# EAGLE design MOD-WiFi-ESP8266_Rev_B1 (EAGLE 4.16)
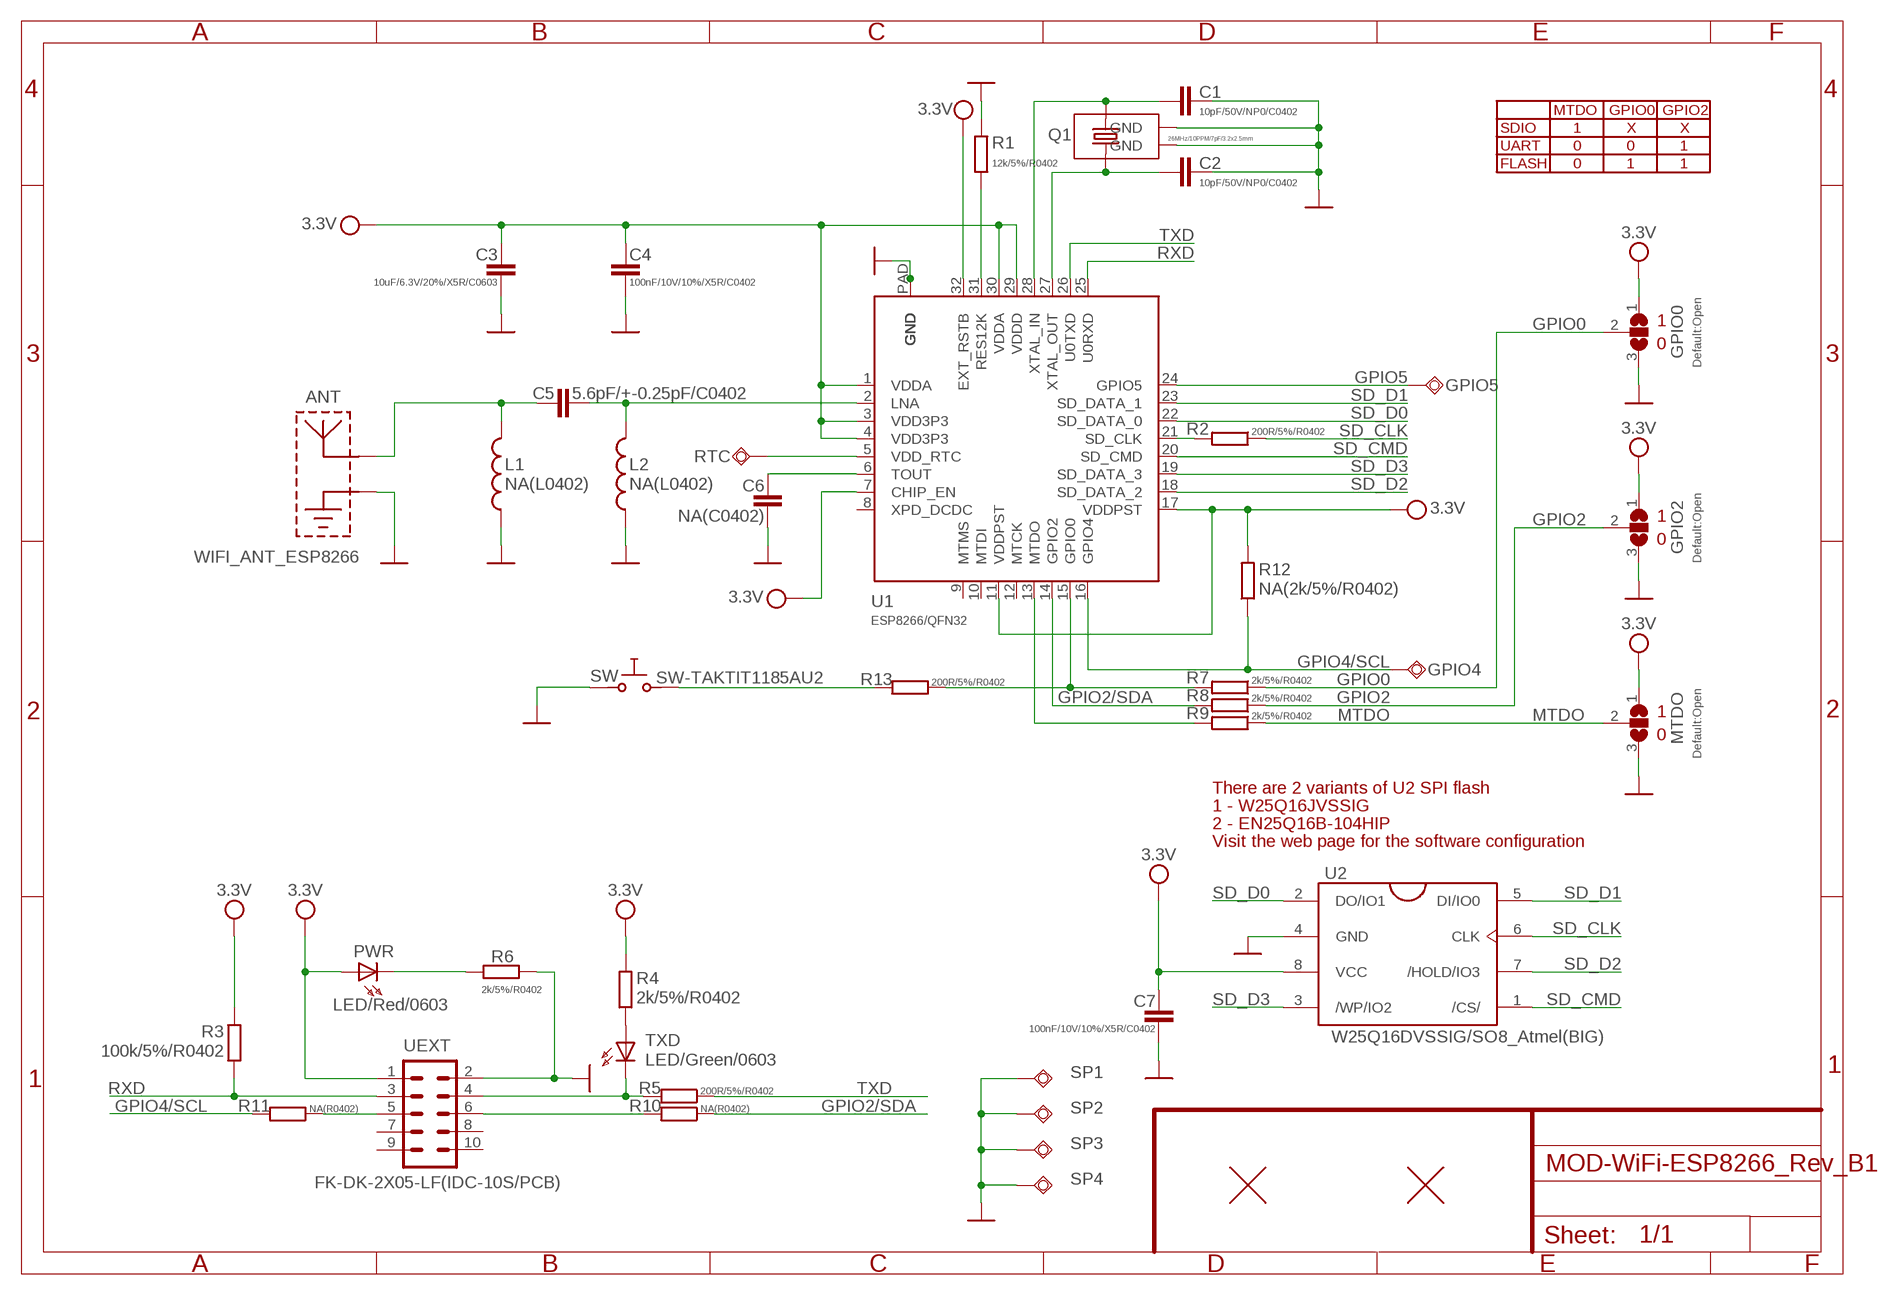
[diagram p0: schematic, sheet 1]

## Parts
ANT  WIFI_ANT_ESP8266  [ESP8266_ANT]
C1  10pF/50V/NP0/C0402  C-EUC0402_TI  [C0402_TI]
C2  10pF/50V/NP0/C0402  C-EUC0402_TI  [C0402_TI]
C3  10uF/6.3V/20%/X5R/C0603  C-EUC0603_DWS  [C0603_DWS]
C4  100nF/10V/10%/X5R/C0402  C-EUC0402_TI  [C0402_TI]
C5  5.6pF/+-0.25pF/C0402  C-EUC0402_TI  [C0402_TI]
C6  NA(C0402)  C-EUC0402_TI  [C0402_TI]
C7  100nF/10V/10%/X5R/C0402  C-EUC0402_TI  [C0402_TI]
GPIO0  Default:Open  SJ2W4  [SJ_2_SMALLER]
GPIO2  Default:Open  SJ2W4  [SJ_2_SMALLER]
GPIO4  TESTPAD32/56  [TESTPAD32/56]
GPIO5  TESTPAD32/56  [TESTPAD32/56]
L1  NA(L0402)  L-USL0402_TI  [L0402_TI]
L2  NA(L0402)  L-USL0402_TI  [L0402_TI]
MTDO  Default:Open  SJ2W4  [SJ_2_SMALLER]
PWR  LED/Red/0603  LEDLED-0603_TEST  [LED-0603_TEST]
Q1  26MHz/10PPM/7pF/3.2x2.5mm  SMALL_SMD_CRYSTAL_1  [NX3225SA]
R1  12k/5%/R0402  R-EU_R0402_TI  [R0402_TI]
R2  200R/5%/R0402  R-EU_R0402_TI  [R0402_TI]
R3  100k/5%/R0402  R-EU_R0402_TI  [R0402_TI]
R4  2k/5%/R0402  R-EU_R0402_TI  [R0402_TI]
R5  200R/5%/R0402  R-EU_R0402_TI  [R0402_TI]
R6  2k/5%/R0402  R-EU_R0402_TI  [R0402_TI]
R7  2k/5%/R0402  R-EU_R0402_TI  [R0402_TI]
R8  2k/5%/R0402  R-EU_R0402_TI  [R0402_TI]
R9  2k/5%/R0402  R-EU_R0402_TI  [R0402_TI]
R10  NA(R0402)  R-EU_R0402_TI  [R0402_TI]
R11  NA(R0402)  R-EU_R0402_TI  [R0402_TI]
R12  NA(2k/5%/R0402)  R-EU_R0402_TI  [R0402_TI]
R13  200R/5%/R0402  R-EU_R0402_TI  [R0402_TI]
RTC  TESTPAD32/56  [TESTPAD32/56]
SP1  TESTPAD120X40  [SMD120X40]
SP2  TESTPAD120X40  [SMD120X40]
SP3  TESTPAD120X40  [SMD120X40]
SP4  TESTPAD120X40  [SMD120X40]
SW  SW-TAKTIT1185AU2  [IT1185AU2]
TXD  LED/Green/0603  LEDLED-0603_TEST  [LED-0603_TEST]
U1  ESP8266/QFN32  ESP8266  [QFN32_PAD]
U2  W25Q16DVSSIG/SO8_Atmel(BIG)  W25Q16BVSSIG  [SO8_ATMEL_FLASH]
U$1  FIDUCIAL  [FIDUCIAL-1X3]
U$2  FIDUCIAL  [FIDUCIAL-1X3]
UEXT  FK-DK-2X05-LF(IDC-10S/PCB)  ML10SMD_1  [ML10L_PADS_FEMAIL]

## Nets
GND: ANT.GND C1.1 C2.1 C3.2 C4.2 C6.2 C7.2 GPIO0.3 GPIO2.3 L1.1 L2.1 MTDO.3 Q1.NC_1(GND) Q1.NC_2(GND) R1.2 R6.1 SP1.1(PP) SP2.1(PP) SP3.1(PP) SP4.1(PP) SW.1 U1.P$1(GND) U1.P$2(GND) U1.P$3(GND) U1.P$4(GND) U1.P$5(GND) U1.P$6(GND) U1.P$7(GND) U1.P$8(GND) U1.P$9(GND) U1.PAD(GND) U2.4(GND) UEXT.2
GPIO0: GPIO0.2 R7.1
GPIO2: GPIO2.2 R8.1
GPIO2/SDA: R8.2 R10.1 U1.14(GPIO2)
GPIO4/SCL: GPIO4.P$1(PP) R11.2 R12.1 U1.16(GPIO4)
GPIO5: GPIO5.P$1(PP) U1.24(GPIO5)
MTDO: MTDO.2 R9.1
N$1: R5.2 TXD.C UEXT.4
N$2: R4.1 TXD.A
N$3: PWR.C R6.2
N$4: R7.2 R13.1 U1.15(GPIO0)
N$5: RTC.P$1(PP) U1.5(VDD_RTC)
N$6: R9.2 U1.13(MTDO)
N$7: R10.2 UEXT.6
N$8: R13.2 SW.2
N$9: R11.1 UEXT.5
N$12: C5.2 L2.2 U1.2(LNA)
N$14: ANT.ANT C5.1 L1.2
N$18: C6.1 U1.6(TOUT)
N$21: C2.2 Q1.2 U1.27(XTAL_OUT)
N$22: R1.1 U1.31(RES12K)
N$23: C1.2 Q1.1 U1.28(XTAL_IN)
N$27: R2.2 U1.21(SD_CLK)
RXD: R3.1 U1.25(U0RXD) UEXT.3
SD_CLK: R2.1 U2.6(CLK)
SD_CMD: U1.20(SD_CMD) U2.1(/CS/)
SD_D0: U1.22(SD_DATA_0) U2.2(DO/IO1)
SD_D1: U1.23(SD_DATA_1) U2.5(DI/IO0)
SD_D2: U1.18(SD_DATA_2) U2.7(/HOLD/IO3)
SD_D3: U1.19(SD_DATA_3) U2.3(/WP/IO2)
TXD: R5.1 U1.26(U0TXD)
VCC: C3.1 C4.1 C7.1 GPIO0.1 GPIO2.1 MTDO.1 PWR.A R3.2 R4.2 R12.2 U1.1(VDDA) U1.3(VDD3P3) U1.4(VDD3P3) U1.7(CHIP_EN) U1.11(VDDPST) U1.17(VDDPST) U1.29(VDDD) U1.30(VDDA) U1.32(EXT_RSTB) U2.8(VCC) UEXT.1 ; supply symbol labelled 3.3V
Unconnected: U1.8(XPD_DCDC) U1.9(MTMS) U1.10(MTDI) U1.12(MTCK) UEXT.7 UEXT.8 UEXT.9 UEXT.10

## Notes on the sheet
- MTDO | GPIO0 | GPIO2
- SDIO | 1 | X | X
- UART | 0 | 0 | 1
- FLASH | 0 | 1 | 1
- 1
- 0
- 1
- 0
- 1
- 0
- There are 2 variants of U2 SPI flash
- 1 - W25Q16JVSSIG
- 2 - EN25Q16B-104HIP
- Visit the web page for the software configuration

## Library data of the parts
ANT = OLIMEX_ANT:WIFI_ANT_ESP8266
C1-C7 = rcl:C-EU: CAPACITOR, European symbol
GPIO0 GPIO2 MTDO = jumper:SJ2W: SMD solder JUMPER
GPIO4 GPIO5 RTC SP1-SP4 = gogo:TESTPAD: drill 40mils, diameter 70mils
L1 L2 = rcl:L-US: INDUCTOR, American symbol
PWR TXD = DOUBLE-SIDE:LED
Q1 = OLIMEX_DISCRET:SMALL_SMD_CRYSTAL
R1-R13 = rcl:R-EU_: RESISTOR, European symbol
SW = gogo:SW-TAKT
U1 = OLIMEX_IC:ESP8266
U2 = OLIMEX_IC:W25Q16BVSSIG
U$1 U$2 = SparkFunEagle-6-6-07:FIDUCIAL: Fiducial Alignment Points Various fiducial points for machine vision alignment.
UEXT = con-harting-ml:ML10: HARTING

## Board
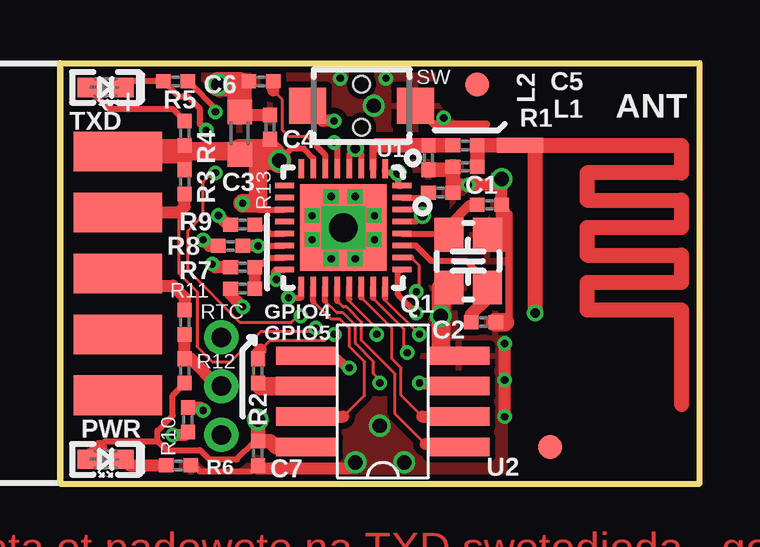
[diagram p1: board, top side]
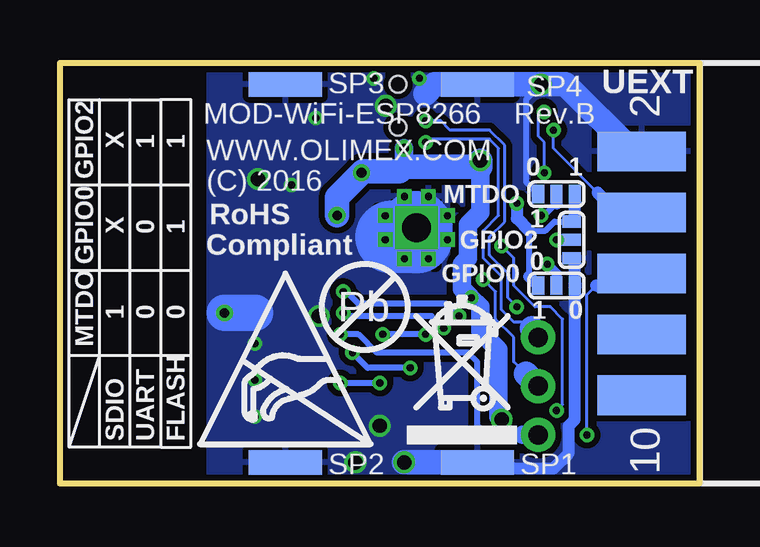
[diagram p2: board, bottom side, seen from below]

Size 26.67 x 17.53 mm. Coordinates in mm from the lower left corner, seen from the top.
Outline: 26.67,0 26.67,17.53 0,17.53 0,0 26.67,0
Copper layers (1+16): Top 0.035mm / dielectric 1.5mm / Bottom 0.035mm
Design rules "default": minimum track width 5mil, minimum drill 0.3mm, track to track 5mil, track to pad 5mil, pad to pad 5mil, via to via 5mil, smd to smd 1mil, copper to edge 5mil, drill to drill 8mil, minimum pad ring 6mil, minimum via ring 6mil, stop-mask expansion 2mil, vias tented up to drill 25mil, thermal gap 10mil
tRestrict: 9 lines
bRestrict: 7 lines

### Footprints (pad centres in the part's own frame; a part is rotated, then mirrored left to right if it is on the bottom)
ESP8266_ANT = smd 0.635 x 1.905: ANT -5.334,-3.302 | drill 0.4 pad 0.635 round: GND 1.651,-2.667
C0402_TI = smd 0.61 x 0.584: 1 -0.508,0; 2 0.508,0
C0603_DWS = smd 1.016 x 1.016: 1 -0.889,0; 2 0.889,0
SJ_2_SMALLER = smd 0.508 x 0.762: 1 -0.762,0; 2 0,0; 3 0.762,0
TESTPAD32/56 = drill 0.813 pad 1.422 round: P$1 0,0
L0402_TI = smd 0.61 x 0.584: 1 -0.508,0; 2 0.508,0
LED-0603_TEST = smd 0.8 x 0.8: A 0.762,0; C -0.762,0
NX3225SA = smd 1.4 x 1.2: 1 -1.1,-0.8; 2 1.1,0.8; NC_1 1.1,-0.8; NC_2 -1.1,0.8
R0402_TI = smd 0.61 x 0.584: 1 -0.508,0; 2 0.508,0
SMD120X40 = smd 3.048 x 1.016: 1 0,0
IT1185AU2 = smd 1.55 x 1.5: 1 -2.25,0; 2 2.25,0 | hole 0.7: 0,-0.9; 0,0.9
QFN32_PAD = smd 0.23 x 0.8: 1 -1.75,-2.45; 2 -1.25,-2.45; 3 -0.75,-2.45; 4 -0.25,-2.45; 5 0.25,-2.45; 6 0.75,-2.45; 7 1.25,-2.45; 8 1.75,-2.45; 17 1.75,2.45; 18 1.25,2.45; 19 0.75,2.45; 20 0.25,2.45; 21 -0.25,2.45; 22 -0.75,2.45; 23 -1.25,2.45; 24 -1.75,2.45 | smd 0.8 x 0.23: 9 2.45,-1.75; 10 2.45,-1.25; 11 2.45,-0.75; 12 2.45,-0.25; 13 2.45,0.25; 14 2.45,0.75; 15 2.45,1.25; 16 2.45,1.75; 25 -2.45,1.75; 26 -2.45,1.25; 27 -2.45,0.75; 28 -2.45,0.25; 29 -2.45,-0.25; 30 -2.45,-0.75; 31 -2.45,-1.25; 32 -2.45,-1.75 | drill 1.2 pad 1.422 square: P$1 0,0 | drill 0.3 pad 0.4 square: P$2 -1.3,0.5; P$3 -1.3,-0.5; P$4 -0.5,-1.3; P$5 0.5,-1.3; P$6 1.3,-0.5; P$7 1.3,0.5; P$8 0.5,1.3; P$9 -0.5,1.3 | smd 3.6 x 3.6: PAD 0,0
SO8_ATMEL_FLASH = smd 0.762 x 2.54: 1 -1.905,-3.175; 2 -0.635,-3.175; 3 0.635,-3.175; 4 1.905,-3.175; 5 1.905,3.175; 6 0.635,3.175; 7 -0.635,3.175; 8 -1.905,3.175
FIDUCIAL-1X3 = smd 1 x 1: 1 0,0
ML10L_PADS_FEMAIL = smd 1.651 x 3.683 bottom: 1 -5.08,-3.429; 3 -2.54,-3.429; 5 0,-3.429; 7 2.54,-3.429; 9 5.08,-3.429 | smd 1.651 x 3.683: 2 -5.08,-3.429; 4 -2.54,-3.429; 6 0,-3.429; 8 2.54,-3.429; 10 5.08,-3.429

### Placement (x,y rotation side)
ANT  22.48,8.76 270 top
C1  17.91,11.62 180 top
C2  17.65,6.73 180 top
C3  7.49,14.61 90 top
C4  8.76,14.86 90 top
C5  16.89,14.1 180 top
C6  8.38,16.76 180 top
C7  8.26,1.27 270 top
GPIO0  5.97,8.26 0 bottom
GPIO2  5.33,10.16 270 bottom
GPIO4  6.73,4.06 0 top
GPIO5  6.73,2.03 0 top
L1  16.89,13.21 0 top
L2  15.37,13.59 90 top
MTDO  5.97,12.06 180 bottom
PWR  1.91,1.02 180 top
Q1  17.02,9.27 270 top
R1  15.88,12.13 0 top
R2  8.26,4.7 90 top
R3  5.21,12.57 90 top
R4  5.21,14.61 270 top
R5  4.83,16.76 180 top
R6  4.95,0.76 180 top
R7  7.62,9.02 0 top
R8  7.11,9.91 0 top
R9  7.62,10.79 0 top
R10  5.33,2.67 270 top
R11  5.21,6.73 270 top
R12  5.21,4.7 270 top
R13  7.62,8.13 180 top
RTC  6.73,6.1 0 top
SP1  9.27,0.89 0 bottom
SP2  17.27,0.89 0 bottom
SP3  17.27,16.64 0 bottom
SP4  9.27,16.64 0 bottom
SW  12.57,15.75 180 top
TXD  1.91,16.51 180 top
U1  11.81,10.67 180 top
U2  13.46,3.43 90 top
U$1  17.4,16.64 180 top
U$2  20.45,1.52 180 top
U$4  [ESD_SYMBOL]  20.83,1.65 0 bottom
U$6  [PB_SMALL]  13.97,7.37 180 bottom
U$7  [RECYCLE_BIN1/8]  12.19,1.65 0 bottom
UEXT  -1.02,8.76 270 bottom

### Tracks (layer width: path | path; a pad name or v marks a point on that pad's centre or on a via)
GND  (via drill 0.3, 0.6)
  Top 0.254: R6.1 5.46,0.64 5.71,0.64 5.84,0.51 8,0.51 C7.2
  Top 0.305: SW.1 15.59,14.99 17.78,14.99 | C1.1 18.41,11.56 18.72,11.25 18.72,6.92
  Top 0.508: 16.38,12.45 18.41,12.45 v18.41,12.7 C1.1 | v18.54,2.79 v18.54,5.84 | C7.2 8.26,0.64 12.06,0.64 v12.32,0.89 | C6.2 7.49,16.76 7.49,16.64 | C4.2 7.49,15.37 C3.2 | 18.41,11.56 18.41,11.18 18.54,11.18 18.54,9.91 17.82,9.91 Q1.NC_2
  Top 0.61: 16.38,13.08 L2.1 | R1.2 16.38,12.45 16.38,13.08 | 16.38,13.08 L1.1
  Top 0.762: U2.4 15.88,5.33 v15.88,6.99 15.88,8.17 Q1.NC_1 | C2.1 18.54,6.73
  Top 1.016: C3.2 7.49,16.64 v6.6,16.64
  Bottom 0.254: MTDO.3 7.24,12.57 7.24,16 v6.6,16.64
  Bottom 0.508: GPIO2.3 5.21,9.27 GPIO0.3 5.21,2.67 5.46,2.41 5.46,1.27 6.1,0.64 9.27,0.64 SP1.1
  Bottom 0.762: 11.31,9.4 11.3,9.4 | U1.P$8 11.31,9.4 | 11.81,10.29 11.81,9.4 11.31,9.4
  Bottom 1.016: UEXT.2 2.79,13.84 5.59,16.64 v6.6,16.64 11.05,16.64 11.43,16.26 | v12.32,0.89 SP1.1
  Bottom 1.524: ANT.GND 18.54,7.11
  Bottom 3.048: U1.P$1 11.81,10.29 12.83,10.29
  other vias: 17.02,12.45 14.35,0.89 13.08,15.75 16,15.24 11.68,16.89 13.59,16.89 18.54,4.32 13.34,2.41
  pour Top (isolate 0.254): -12.7,-2.54 -12.7,20.07 29.21,20.07 29.21,-2.54
  pour Bottom (isolate 0.254): -15.24,-5.08 -15.24,22.61 31.88,22.61 31.88,-5.08
GPIO0  (via drill 0.3)
  Top 0.508: R7.1 6.48,9.02 v6.35,9.14
  Bottom 0.406: GPIO0.2 5.97,8.76 v6.35,9.14
GPIO2  (via drill 0.3)
  Top 0.508: R8.1 6.22,9.91 v5.97,10.16
  Bottom 0.508: v5.97,10.16 GPIO2.2
GPIO2/SDA  (via drill 0.3)
  Top 0.254: U1.14 v8.27,9.92 v8.26,9.91
  Top 0.508: R10.1 5.84,3.17 v5.97,3.05 | v8.26,9.91 R8.2
  Bottom 0.127: v8.26,9.91 7.75,9.4 7.75,8.26 6.86,7.37 6.22,7.37 5.71,6.86 5.71,3.3 v5.97,3.05
GPIO4/SCL  (via drill 0.3)
  Top 0.254: 9.02,8.84 9.1,8.92 U1.16
  Top 0.406: v9.02,8.51 9.02,8.84
  Top 0.508: GPIO4.P$1 6.6,4.06 5.46,5.21 R12.1 R11.2
  Bottom 0.127: v9.02,8.51 8.51,8 8.51,6.86 7.75,6.1 7.75,5.08 7.24,4.57
  Bottom 1.016: GPIO4.P$1 7.24,4.57
GPIO5  (via drill 0.3)
  Top 0.127: 13.56,7.72 13.56,7.65 v14.99,6.22
  Top 0.254: 13.56,7.72 U1.24
  Bottom 0.254: 7.37,2.03 7.49,1.91 8.76,1.91 9.27,2.41 9.27,5.08 9.65,5.46 13.46,5.46 14.22,6.22 v14.99,6.22
  Bottom 0.762: GPIO5.P$1 7.37,2.03
MTDO  (via drill 0.3)
  Top 0.508: R9.1 6.99,10.79 v6.6,11.18
  Bottom 0.254: v6.6,11.18 6.48,11.18 5.97,11.68
  Bottom 0.508: 5.97,11.68 MTDO.2
N$1  (via drill 0.3)
  Top 0.254: TXD.C 2.67,16.76 R5.2 4.95,16.13 5.33,16.13 5.84,15.62 5.84,14.99 v6.1,14.73
  Bottom 0.127: 4.25,12.13 6.1,13.97 v6.1,14.73
  Bottom 0.508: UEXT.4 3.43,11.3 4.25,12.13
N$2
  Top 0.254: TXD.A 2.03,15.62 4.7,15.62 R4.1
N$3
  Top 0.508: R6.2 2.92,0.76 PWR.C
N$4
  Top 0.254: R7.2 8.26,9.14 8.43,9.14 8.71,9.42 U1.15
  Top 0.508: R13.1 R7.2
N$5  (via drill 0.3)
  Top 0.254: U1.5 11.56,14.09 v11.43,14.22
  Bottom 0.127: v11.43,14.22 11.3,14.35 8.76,14.35 8.38,13.97 8.38,11.18 9.02,10.54 9.02,9.4 8.26,8.64 8.26,7.24 7.75,6.73 7.24,6.73 6.99,6.48
  Bottom 1.016: RTC.P$1 6.73,6.22 6.99,6.48
N$6
  Top 0.254: R9.2 8.26,10.67 8.51,10.67 8.76,10.42 U1.13
N$7  (via drill 0.3)
  Top 0.508: v4.7,2.03 5.21,2.03 R10.2
  Bottom 0.127: v4.7,2.03 4.7,7.87 4.32,8.26
  Bottom 0.508: 4.32,8.26 2.41,8.26 UEXT.6
N$8  (via drill 0.3)
  Top 0.508: SW.2 10.96,15.11 v11.43,15.11 | R13.2 7.11,7.87 v7.62,7.37
  Bottom 0.127: v11.43,15.11 10.79,15.11 10.41,14.73 8.76,14.73 8.13,14.1 8.13,10.92 8.76,10.29 8.76,9.53 8,8.76 8,7.75 v7.62,7.37
N$9
  Top 0.508: UEXT.5 2.92,8.26 4.7,8.26 5.21,7.75 R11.1
N$12
  Top 0.305: U1.2 13.06,13.95 13.21,14.1
  Top 0.61: C5.2 L2.2 13.21,14.1
N$14
  Top 0.61: L1.2 C5.1 ANT.ANT
N$18
  Top 0.127: 8.89,16.38 9.27,16 9.27,14.73 9.53,14.48 10.29,14.48 10.68,14.09
  Top 0.254: 10.68,14.09 11.06,13.7 U1.6
  Top 0.508: 8.89,16.38 C6.1
N$21
  Top 0.254: U1.27 14.85,9.92 15.49,9.27 16.97,9.27 17.82,8.42 Q1.2
  Top 0.508: C2.2 17.14,7.06 17.82,7.73 Q1.2
N$22
  Top 0.254: U1.31 15.16,11.92 R1.1
N$23
  Top 0.254: Q1.1 15.75,10.37 15.75,10.41 15.74,10.42 U1.28
  Top 0.406: C1.2 17.08,11.62 16.22,10.76 Q1.1
N$27  (via drill 0.3)
  Top 0.127: v13.21,6.22 13.21,6.48 12.06,7.62 12.06,7.7 | 8.38,5.59 8.76,5.97 11.05,5.97 11.3,6.22 v11.43,6.22
  Top 0.254: 12.06,7.7 U1.21
  Top 0.508: R2.2 8.26,5.46 8.38,5.59
  Bottom 0.254: v11.43,6.22 v13.21,6.22
RXD  (via drill 0.3)
  Top 0.127: 4.95,11.3 4.95,8.76 5.71,8 5.71,5.71 6.35,5.08 7.11,5.08 8.38,6.35 10.54,6.35 v10.67,6.48
  Top 0.254: v14.86,7.11 14.1,7.87 14.1,8.92 U1.25
  Top 0.508: UEXT.3 4.95,11.3 5.21,11.56 R3.1
  Bottom 0.254: v10.67,6.48 11.18,6.99 14.73,6.99 v14.86,7.11
SD_CLK
  Top 0.61: R2.1 8.38,4.06
  Top 0.762: 8.38,4.06 U2.6
SD_CMD
  Top 0.127: 11.56,7.62 11.81,7.37 11.94,7.37 12.57,6.73 12.57,5.97 13.97,4.57 13.97,2.92 15.24,1.65
  Top 0.254: 11.56,7.62 U1.20
  Top 0.508: U2.1 16.51,1.65 15.24,1.65
SD_D0
  Top 0.127: 12.56,7.76 13.84,6.48 13.84,5.21 14.22,4.83 14.22,3.68 15.11,2.79
  Top 0.254: 12.56,7.76 U1.22
  Top 0.508: 15.11,2.79 U2.2
SD_D1  (via drill 0.3)
  Top 0.127: v14.48,5.46 14.35,5.59 14.35,6.44 13.06,7.73
  Top 0.254: 13.06,7.73 U1.23
  Top 0.406: v12.06,4.83 11.94,4.83 11.43,5.33 U2.5
  Bottom 0.254: v12.06,4.83 13.84,4.83 v14.48,5.46
SD_D2
  Top 0.127: 10.56,7.6 11.3,6.86 11.68,6.86 12.06,6.48 12.06,5.71 12.7,5.08 12.7,3.68 11.81,2.79
  Top 0.254: 10.56,7.6 U1.18
  Top 0.508: U2.7 11.81,2.79
SD_D3  (via drill 0.3)
  Top 0.127: v13.34,4.19 13.34,4.32 13.08,4.57 13.08,5.08 12.32,5.84 12.32,6.6 11.81,7.11 11.56,7.11 11.06,7.61
  Top 0.254: 11.06,7.61 U1.19
  Top 0.508: U2.3 16.51,4.19 v14.99,4.19
  Bottom 0.254: v13.34,4.19 v14.99,4.19
TXD  (via drill 0.3)
  Top 0.127: 14.65,9.42 14.99,9.08 14.99,8.13 v14.86,8 | v6.48,12.95 6.35,12.95 5.97,12.57 5.97,11.18 5.33,10.54 5.33,8.89 7.49,6.73 9.65,6.73 9.91,6.99 v10.03,6.99
  Top 0.254: 14.65,9.42 U1.26 | v6.48,15.49 6.48,15.62 5.46,16.64 5.21,16.64 R5.1
  Bottom 0.127: v6.48,12.95 6.48,14.22 6.73,14.48 6.73,15.24 v6.48,15.49
  Bottom 0.254: v14.86,8 14.73,8 14.22,7.49 10.54,7.49 v10.03,6.99
VCC  (via drill 0.3, 0.4, 0.6)
  Top 0.254: U1.7 10.56,13.57 10.16,13.97 9.65,13.97 v9.14,13.46 8.89,13.72 8.76,13.72 C4.1 | U1.4 12.06,13.71 v12.32,13.97 12.56,13.73 U1.3 | U1.1 13.56,12.95 v14.1,12.95 14.1,12.42 U1.32 | U1.30 14.87,11.42 v15.11,11.18 14.86,10.92 U1.29 | v9.53,7.75 10.06,7.75 U1.17 | 8.26,11.68 8.26,11.42 U1.11 | 1.65,1.52 1.91,1.78 4.06,1.78 | 4.06,1.78 4.45,1.4 5.84,1.4 6.22,1.02 7.37,1.02 8.13,1.78 C7.1 | R12.2 4.7,3.68 4.7,2.85 4.06,2.21 4.06,1.78
  Top 0.61: PWR.A 1.65,1.52 | v8.26,2.67 C7.1 8.76,1.78 9.02,1.52 U2.8 | R4.2 5.21,13.84 R3.2
  Top 0.762: v7.62,11.68 8.26,11.68 8.26,13.46 v9.14,13.46 | 7.49,13.84 5.21,13.84
  Top 1.016: C3.1 7.49,13.84 8.76,13.84 v9.14,13.46 | 5.21,13.84 UEXT.1
  Bottom 0.254: GPIO2.1 6.04,10.92 6.43,10.54 7.11,10.54 7.11,8.64
  Bottom 0.508: 7.11,8.64 GPIO0.1 | GPIO2.1 5.21,10.92 MTDO.1 | v7.62,11.68 7.62,11.05 7.11,10.54
  Bottom 0.762: v8.26,2.67 8.38,2.79 8.38,5.59 9.14,6.35 9.14,7.37 v9.53,7.75 9.91,8.13 9.91,9.14 9.65,9.4 9.65,10.79 9.14,11.3 9.14,13.21 | 12.32,13.21 v12.32,13.97 | 14.03,13.02 v14.1,12.95
  Bottom 1.016: v9.14,13.46 9.14,13.21 12.32,13.21 12.51,13.02 14.03,13.02 | v15.11,11.18 15.11,11.94 v14.1,12.95

### Text on the board
Top: DA mahne edinicata ot padowete na TXD swetodioda - gore vliavo na top | DA mahne krygcheto mejdu kristala i U1
bPlace: 1 | 1 | X | GPIO2 | 1 | 0 | X | GPIO0 | 0 | 0 | 1 | MTDO | FLASH | UART | SDIO
bNames: Rev.B | MOD-WiFi-ESP8266 | 1 | 0 | WWW.OLIMEX.COM | (C) 2016 | 1 | RoHS | 0 | Compliant | 0 | 1 | 10
201bmp: C:/YASSEN_ON_C-YASSEN-REBORN/TASKS/MOD-nRF8001===P/Nordic_NRF8001/nRF8001-Gerber Files/with DCDC/!PICLIST-0909+++.BMP